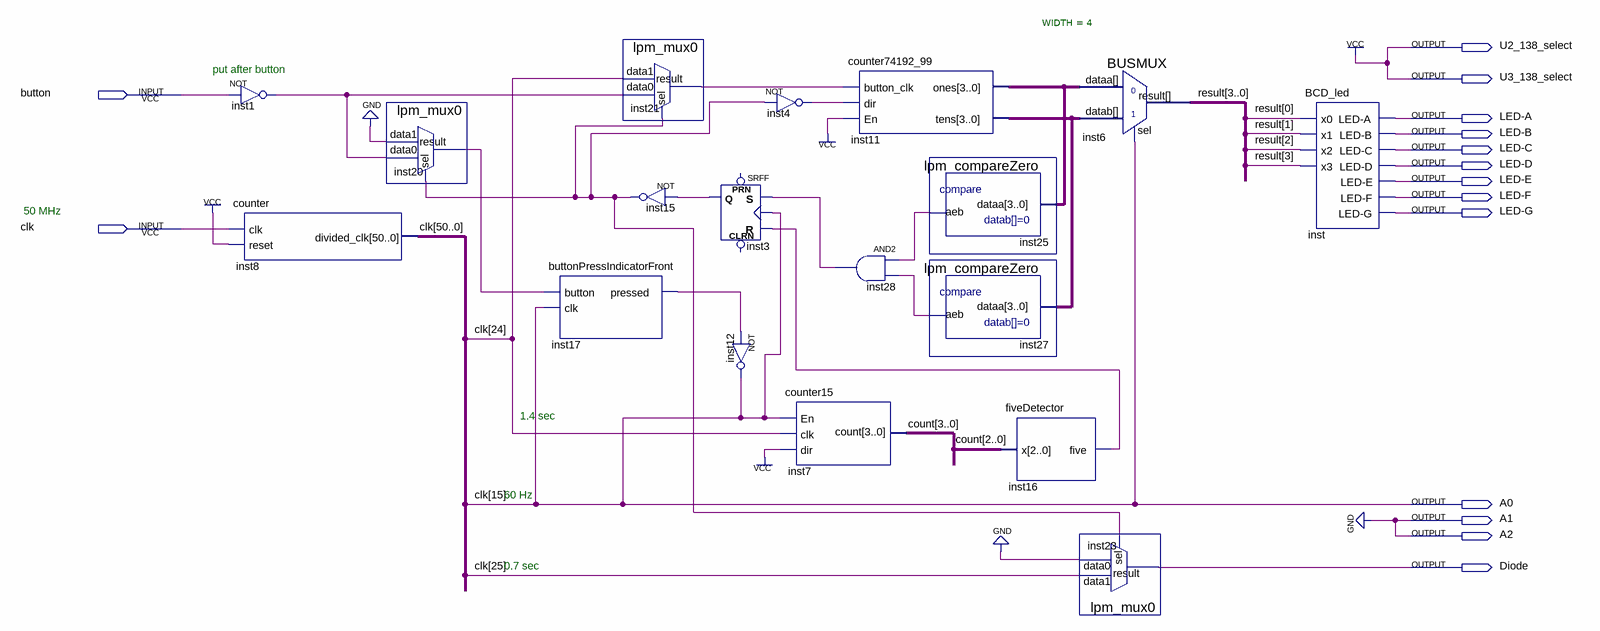
[diagram p0: schematic sheet]
// Quartus schematic LAB1.bdf as structural Verilog: 18 symbols, 15 pins
module LAB1 (
  input  button,
  input  clk,
  output U2_138_select,
  output U3_138_select,
  output \LED-A ,
  output \LED-B ,
  output \LED-C ,
  output \LED-D ,
  output \LED-E ,
  output \LED-F ,
  output \LED-G ,
  output A0,
  output A1,
  output A2,
  output Diode
);

  wire inst1_out, inst3_q, inst4_out, inst15_out, inst16_five, inst17_pressed, inst20_result, inst21_result,
       inst25_aeb, inst27_aeb, inst28_out;
  wire [3:0] count, inst11_ones, inst11_tens, result;
  wire [50:0] clk_bus;

  not inst1 (inst1_out, button);
  counter inst8 (.clk(clk), .reset(1'b1), .divided_clk({clk_bus[50:16], A0, clk_bus[14:0]}));
  lpm_mux0 inst20 (.data1(1'b0), .data0(inst1_out), .sel(inst15_out), .result(inst20_result));
  buttonPressIndicatorFront inst17 (.button(inst20_result), .clk(A0), .pressed(inst17_pressed));
  lpm_mux0 inst21 (.data1(clk_bus[24]), .data0(inst1_out), .sel(inst15_out), .result(inst21_result));
  not inst15 (inst15_out, inst3_q);
  SRFF inst3 (.S(inst28_out), .R(inst16_five), .CLK(A0), .Q(inst3_q));  // open: PRN, CLRN
  not inst12 (A0, inst17_pressed);
  not inst4 (inst4_out, inst15_out);
  counter15 inst7 (.En(A0), .clk(clk_bus[24]), .dir(1'b1), .count(count));
  counter74192_99 inst11 (
    .button_clk(inst21_result), .dir(inst4_out), .En(1'b1), .ones(inst11_ones), .tens(inst11_tens));
  and inst28 (inst28_out, inst25_aeb, inst27_aeb);
  lpm_compareZero inst25 (.dataa(inst11_ones), .aeb(inst25_aeb));
  lpm_compareZero inst27 (.dataa(inst11_tens), .aeb(inst27_aeb));
  fiveDetector inst16 (.x(count[2:0]), .five(inst16_five));
  BUSMUX #(.WIDTH(4)) inst6 (.datab(inst11_tens), .sel(A0), .dataa(inst11_ones), .result(result));
  lpm_mux0 inst23 (.data1(clk_bus[25]), .data0(1'b0), .sel(inst15_out), .result(Diode));
  BCD_led inst (
    .x0(result[0]), .x1(result[1]), .x2(result[2]), .x3(result[3]), .\LED-A (\LED-A ), .\LED-B (\LED-B ),
    .\LED-C (\LED-C ), .\LED-D (\LED-D ), .\LED-E (\LED-E ), .\LED-F (\LED-F ), .\LED-G (\LED-G ));

  assign A1 = 1'b0;
  assign A2 = 1'b0;
  assign U2_138_select = 1'b1;
  assign U3_138_select = 1'b1;

  // Other names for the same wires on the sheet: clk[15] = A0

  // Notes on the sheet:
  //   put after button
  //   50 MHz
  //   1.4 sec
  //   60 Hz
  //   0.7 sec
endmodule
